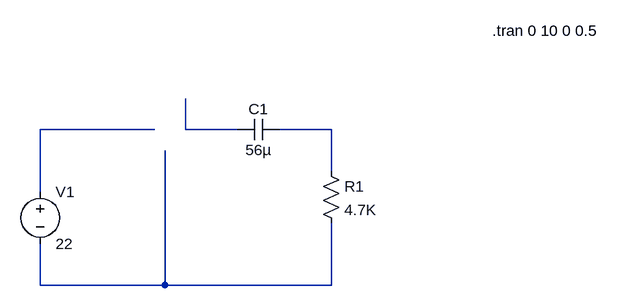
[diagram p0: schematic EJ8_teoría.asc]
EJ8_teoría.asc, the LTspice schematic file:
Version 4.1
SHEET 1 920 680
WIRE 208 -192 32 -192
WIRE 256 -192 256 -240
WIRE 336 -192 256 -192
WIRE 480 -192 400 -192
WIRE 480 -128 480 -192
WIRE 32 -96 32 -192
WIRE 32 48 32 -16
WIRE 224 48 224 -160
WIRE 224 48 32 48
WIRE 480 48 480 -48
WIRE 480 48 224 48
SYMBOL voltage 32 -112 R0
SYMATTR InstName V1
SYMATTR Value 22
SYMBOL cap 400 -208 R90
WINDOW 0 0 32 VBottom 2
WINDOW 3 32 32 VTop 2
SYMATTR InstName C1
SYMATTR Value 56µ
SYMBOL res 464 -144 R0
SYMATTR InstName R1
SYMATTR Value 4.7K
TEXT 728 -344 Left 2 !.tran 0 10 0 0.5

The netlist it stands for:
* EJ8_teoría.asc
V1 N001 N004 22
C1 N003 N002 56µ
R1 N003 N004 4.7K
.tran 0 10 0 0.5
.backanno
.end